# EAGLE design tm9 (EAGLE 9.6.2)
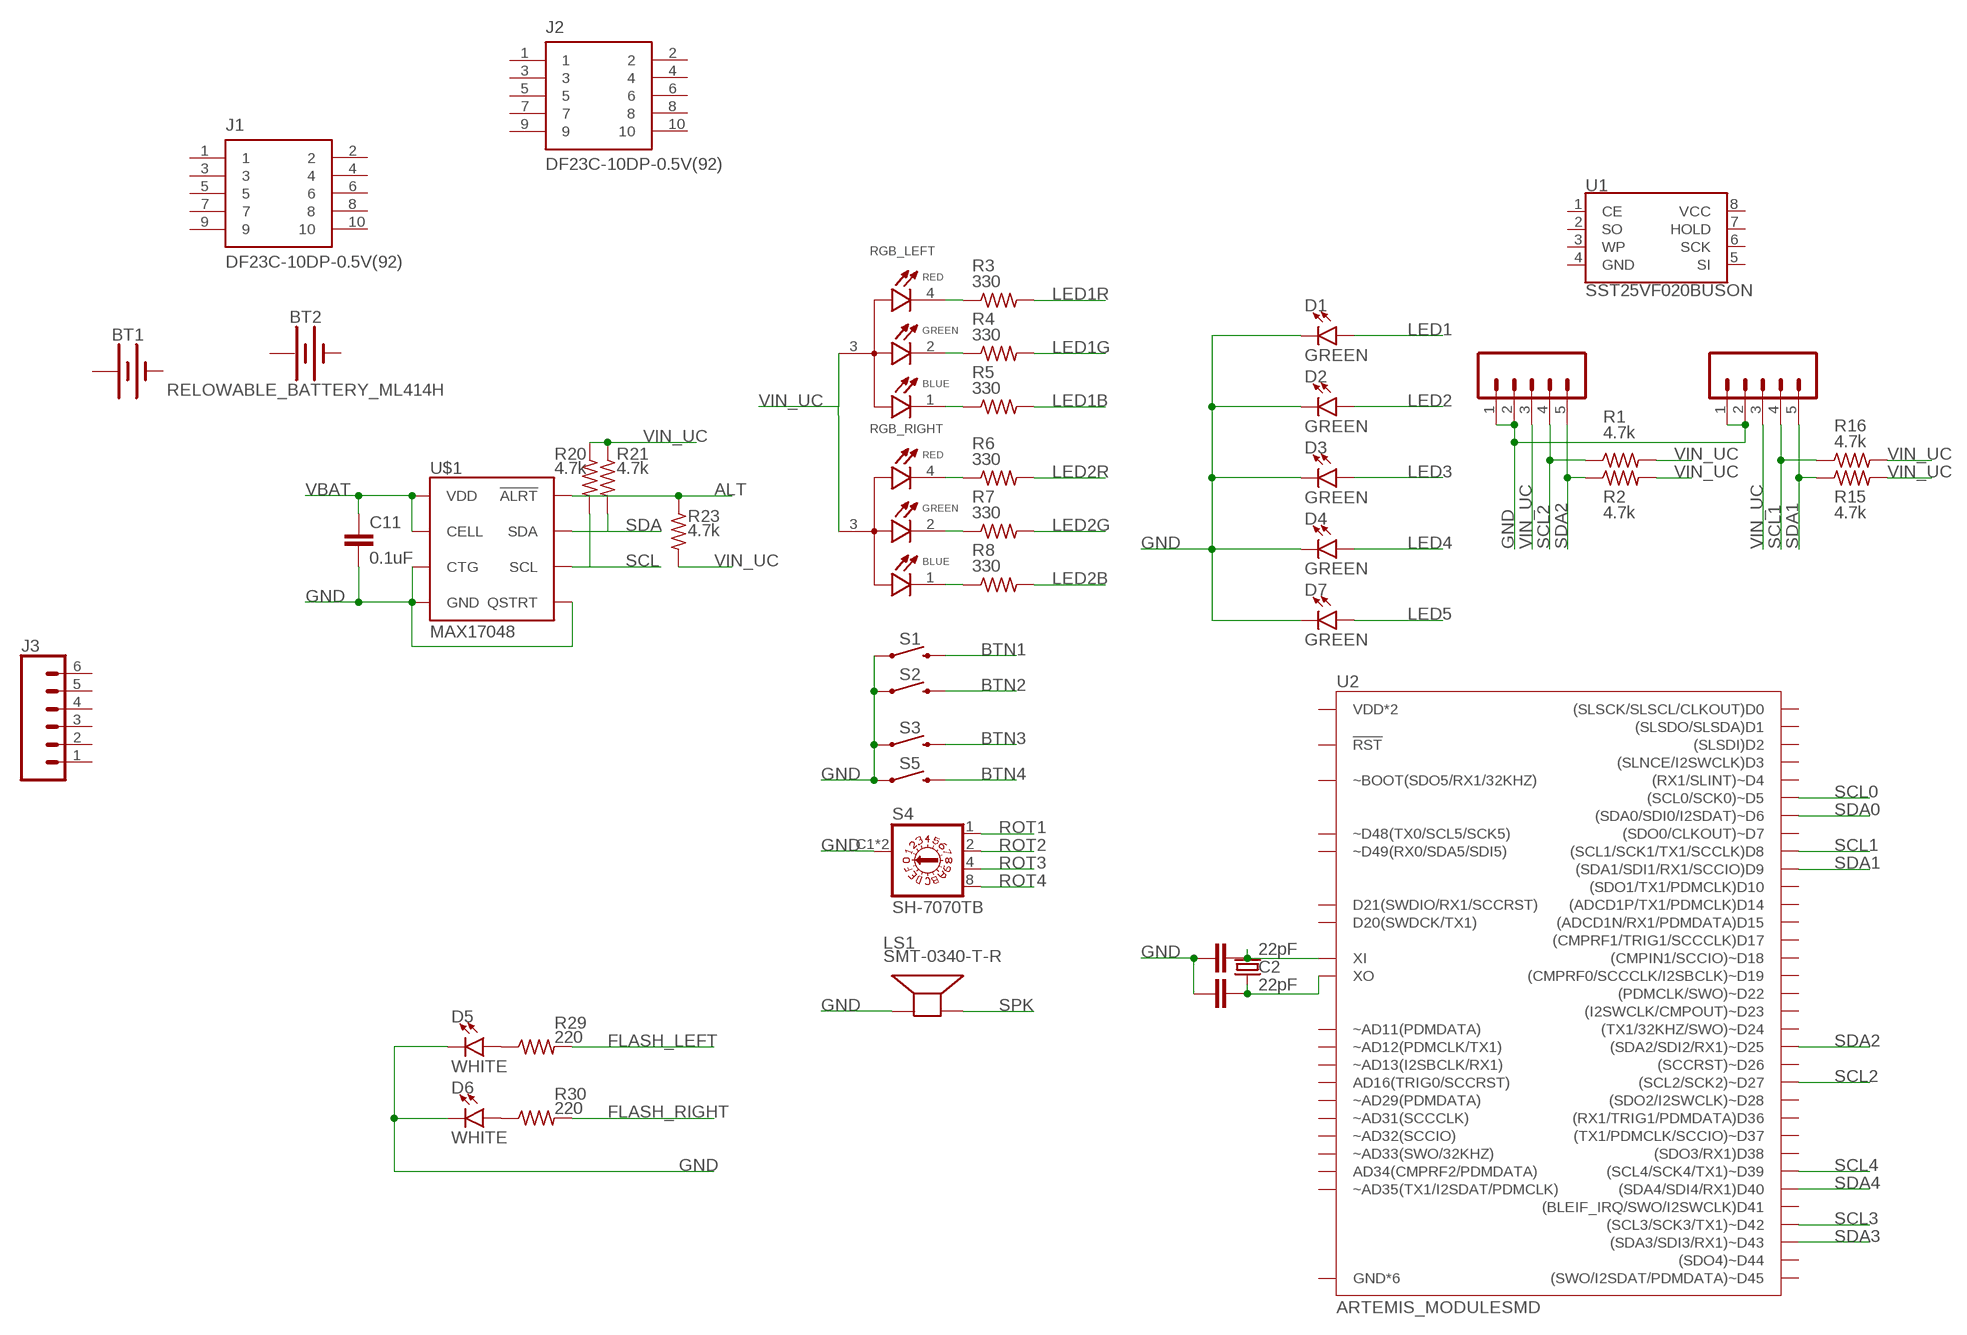
[diagram p0: schematic, sheet 1]

## Parts
BT1  BATTERY-20MM_SMD_4LEGS_OVERPASTE_INNER  [BATTCON_20MM_4LEGS_OVERPASTE_INNER]
BT2  RELOWABLE_BATTERY_ML414H  [ML414H_IV01E]
C1  22pF  C-EUC0402  [C0402]
C2  22pF  C-EUC0402  [C0402]
C11  0.1uF  C-EUC0402  [C0402]
D1  GREEN  LED-GREEN1206  [LED-1206]
D2  GREEN  LED-GREEN1206  [LED-1206]
D3  GREEN  LED-GREEN1206  [LED-1206]
D4  GREEN  LED-GREEN1206  [LED-1206]
D5  WHITE  LED-WHITE1206  [LED-1206]
D6  WHITE  LED-WHITE1206  [LED-1206]
D7  GREEN  LED-GREEN1206  [LED-1206]
J1  DF23C-10DP-0.5V(92)  [HIROSE_DF23C-10DP-0.5V(92)]
J2  DF23C-10DP-0.5V(92)  [HIROSE_DF23C-10DP-0.5V(92)]
J3  CONN_06JST-SMD-LOCKING  [JST-6-SMD-1.25MM-LOCKING]
LCD1  CONN_05VERT_FEMALE_HEADER  [1X05_SMD_VERTICAL_COMBO]
LCD2  CONN_05VERT_FEMALE_HEADER  [1X05_SMD_VERTICAL_COMBO]
LS1  SMT-0340-T-R  [XDCR_SMT-0340-T-R]
R1  4.7k  R-US_R0402  [R0402]
R2  4.7k  R-US_R0402  [R0402]
R3  330  R-US_R0402  [R0402]
R4  330  R-US_R0402  [R0402]
R5  330  R-US_R0402  [R0402]
R6  330  R-US_R0402  [R0402]
R7  330  R-US_R0402  [R0402]
R8  330  R-US_R0402  [R0402]
R15  4.7k  R-US_R0402  [R0402]
R16  4.7k  R-US_R0402  [R0402]
R20  4.7k  R-US_R0402  [R0402]
R21  4.7k  R-US_R0402  [R0402]
R23  4.7k  R-US_R0402  [R0402]
R29  220  R-US_R0402  [R0402]
R30  220  R-US_R0402  [R0402]
RGB_LEFT  EAST1616RGBA3  [LED_EAST1616RGBA3]
RGB_RIGHT  EAST1616RGBA3  [LED_EAST1616RGBA3]
S1  MOMENTARY-SWITCH-SPST-SMD-6.0X3.5MM  [TACTILE_SWITCH_SMD_6.0X3.5MM]
S2  MOMENTARY-SWITCH-SPST-SMD-6.0X3.5MM  [TACTILE_SWITCH_SMD_6.0X3.5MM]
S3  MOMENTARY-SWITCH-SPST-SMD-6.0X3.5MM  [TACTILE_SWITCH_SMD_6.0X3.5MM]
S4  SH-7070TB  [SH-7070B]
S5  MOMENTARY-SWITCH-SPST-SMD-6.0X3.5MM  [TACTILE_SWITCH_SMD_6.0X3.5MM]
U1  SST25VF020BUSON  [USON_3X2MM]
U2  ARTEMIS_MODULESMD  [ARTEMIS_FP]
U$1  MAX17048  MAX17048DFN8  [DFN-8]
Y1  32.768kHz  CRYSTAL-32.768KHZSMD-3.2X1.5  [CRYSTAL-SMD-3.2X1.5MM]

## Nets
ALT: R23.1 U$1.P$5(!ALRT)
BTN1: S1.2
BTN2: S2.2
BTN3: S3.2
BTN4: S5.2
FLASH_LEFT: R29.2
FLASH_RIGHT: R30.2
GND: C1.1 C2.1 C11.2 D1.C D2.C D3.C D4.C D5.C D6.C D7.C LCD1.1 LCD1.2 LCD2.1 LCD2.2 LS1.P S1.1 S2.1 S3.1 S4.C1(C) S4.C2(C) S5.1 U$1.P$1(CTG) U$1.P$4(GND) U$1.P$6(QSTRT) U$1.P$9(GND)
LED1: D1.A
LED1B: R5.2
LED1G: R4.2
LED1R: R3.2
LED2: D2.A
LED2B: R8.2
LED2G: R7.2
LED2R: R6.2
LED3: D3.A
LED4: D4.A
LED5: D7.A
N$5: R3.1 RGB_LEFT.4(R_C)
N$6: R4.1 RGB_LEFT.2(G_C)
N$7: R5.1 RGB_LEFT.1(B_C)
N$8: R6.1 RGB_RIGHT.4(R_C)
N$9: R7.1 RGB_RIGHT.2(G_C)
N$10: R8.1 RGB_RIGHT.1(B_C)
N$16: D5.A R29.1
N$18: D6.A R30.1
ROT1: S4.1
ROT2: S4.2
ROT3: S4.4
ROT4: S4.8
SCL: R20.2 U$1.P$7(SCL)
SCL0: U2.~D5((SCL0/SCK0)~D5)
SCL1: LCD2.4 R16.1 U2.D8((SCL1/SCK1/TX1/SCCLK)D8)
SCL2: LCD1.4 R1.1 U2.~D27((SCL2/SCK2)~D27)
SCL3: U2.~D42((SCL3/SCK3/TX1)~D42)
SCL4: U2.~D39((SCL4/SCK4/TX1)~D39)
SDA: R21.2 U$1.P$8(SDA)
SDA0: U2.~D6((SDA0/SDI0/I2SDAT)~D6)
SDA1: LCD2.5 R15.1 U2.D9((SDA1/SDI1/RX1/SCCIO)D9)
SDA2: LCD1.5 R2.1 U2.~D25((SDA2/SDI2/RX1)~D25)
SDA3: U2.~D43((SDA3/SDI3/RX1)~D43)
SDA4: U2.D40((SDA4/SDI4/RX1)D40)
SPK: LS1.N
VBAT: C11.1 U$1.P$2(CELL) U$1.P$3(VDD)
VIN_UC: LCD1.3 LCD2.3 R1.2 R2.2 R15.2 R16.2 R20.1 R21.1 R23.2 RGB_LEFT.3(A) RGB_RIGHT.3(A)
XIN32: C1.2 U2.XI Y1.P$2
XOUT32: C2.2 U2.XO Y1.P$1
Unconnected: J1.1 J1.2 J1.3 J1.4 J1.5 J1.6 J1.7 J1.8 J1.9 J1.10 J2.1 J2.2 J2.3 J2.4 J2.5 J2.6 J2.7 J2.8 J2.9 J2.10 J3.1 J3.2 J3.3 J3.4 J3.5 J3.6 U1.1(CE) U1.2(SO) U1.3(WP) U1.5(SI) U1.6(SCK) U1.7(HOLD) U2.AD16(AD16(TRIG0/SCCRST)) U2.AD34(AD34(CMPRF2/PDMDATA)) U2.BOOT(~BOOT(SDO5/RX1/32KHZ)) U2.D0((SLSCK/SLSCL/CLKOUT)D0) U2.D1((SLSDO/SLSDA)D1) U2.D2((SLSDI)D2) U2.D3((SLNCE/I2SWCLK)D3) U2.D7((SDO0/CLKOUT)~D7) U2.D10((SDO1/TX1/PDMCLK)D10) U2.D14((ADCD1P/TX1/PDMCLK)D14) U2.D15((ADCD1N/RX1/PDMDATA)D15) U2.D17((CMPRF1/TRIG1/SCCCLK)D17) U2.D36((RX1/TRIG1/PDMDATA)D36) U2.D38((SDO3/RX1)D38) U2.D41((BLEIF_IRQ/SWO/I2SWCLK)D41) U2.GND@1(GND*6) U2.GND@22(GND*6) U2.GND@38(GND*6) U2.GND@39(GND*6) U2.GND@47(GND*6) U2.GND@59(GND*6) U2.RXI-0(~D49(RX0/SDA5/SDI5)) U2.SWDCK(D20(SWDCK/TX1)) U2.SWDIO(D21(SWDIO/RX1/SCCRST)) U2.TXO-0(~D48(TX0/SCL5/SCK5)) U2.VDD@36(VDD*2) U2.VDD@37(VDD*2) U2.~AD11(~AD11(PDMDATA)) U2.~AD12(~AD12(PDMCLK/TX1)) U2.~AD13(~AD13(I2SBCLK/RX1)) U2.~AD29(~AD29(PDMDATA)) U2.~AD31(~AD31(SCCCLK)) U2.~AD32(~AD32(SCCIO)) U2.~AD33/SWO(~AD33(SWO/32KHZ)) U2.~AD35(~AD35(TX1/I2SDAT/PDMCLK)) U2.~D4((RX1/SLINT)~D4) U2.~D18((CMPIN1/SCCIO)~D18) U2.~D19((CMPRF0/SCCCLK/I2SBCLK)~D19) U2.~D22((PDMCLK/SWO)~D22) U2.~D23((I2SWCLK/CMPOUT)~D23) U2.~D24((TX1/32KHZ/SWO)~D24) U2.~D26((SCCRST)~D26) U2.~D28((SDO2/I2SWCLK)~D28) U2.~D37((TX1/PDMCLK/SCCIO)~D37) U2.~D44((SDO4)~D44) U2.~D45((SWO/I2SDAT/PDMDATA)~D45) U2.~RST(!RST)

## Notes on the sheet
- R20 | R21
- R23
- R29
- R30

## Power pins joined to a net without a drawn wire
+: BT1.1(+) BT2.+
-: BT1.2(-) BT2.-
GND: U1.4(GND)
VCC: U1.8(VCC)

## Library data of the parts
BT1 = SparkFun-Batteries:BATTERY: Battery - Single Cell A variety of battery chemistries, sizes, and footprints. Device List: 20MM_PTH - Coin Cell Battery Holder - 20mm (PTH) <https://www.sparkfun.com/products/783> 20MM_PTH_KIT- Coin Cell battery Holder - 20 mm (PTH) <http://www.sparkfun.com/products/783>kit version with special mask 6.8MM_PTH - Coin Cell Battery Holder - 6.8MM(SMD) <https://www.digikey.com/product-detail/en/seiko-instruments/MS621FE-FL11E/728-1057-ND/1889208?WT.srch=1&gclid=CNOQ5a6LzdQCFZS2wAodXCkE0g> 12MM_SMD - Coin Cell Battery Holder - 12mm (SMD) <https://www.sparkfun.com/products/10592> 12MM_PTH - Coin Cell Battery Holder - 12mm (PTH) <https://www.sparkfun.com/products/7948> 20MM_SMD - 20mm Coin Cell Battery Holder (SMD) (2 legs) Used on the Big Time Watch Kit <https://www.sparkfun.com/products/11734> 20MM_SMD_4LEGS - Coin Cell Battery Holder - 20mm (SMD) <https://www.sparkfun.com/products/11892> 20MM_SMD_4LEGS_OVERPASTE - Coin Cell Battery Holder - 20mm (SMD) <https://www.sparkfun.com/products/11892> (Over-paste on the legs) 24.5MM_PTH - Coin Cell Battery Holder - 24.5mm (PTH) <https://www.sparkfun.com/products/8863> 9V - 9V Battery Holder - PC Mount Used on the SparkFun SparkPunk Sound Kit <https://www.sparkfun.com/products/11177> and SparkFun SparkPunk Sequencer Kit <https://www.sparkfun.com/products/12707> 18650 - Battery Holder - 18650 (PTH) <https://www.sparkfun.com/products/13113> AA - Battery Holder - 1xAA (PTH) <https://www.sparkfun.com/products/7949> AAA - Battery Holder - 1xAAA (PTH) <https://www.sparkfun.com/products/12718> AA_KIT - Battery Holder - 1xAA (PTH) <https://www.sparkfun.com/products/7949> Special kit package - pads only have exposed copper on one side of the board. AAA_KIT - Battery Holder - 1xAAA (PTH) <https://www.sparkfun.com/products/12718> Special kit package - pads only have exposed copper on one side of the board.
BT2 = SparkFun-Batteries:RELOWABLE_BATTERY: SEIKO Reflowable Lithium Batteries; PROD_ID: BATT-14267
C1 C2 C11 = rcl:C-EU: CAPACITOR, European symbol; SPICEPREFIX: C
D1-D4 D7 = SparkFun-LED:LED-GREEN: Green SMD LED Used in manufacturing of various products at SparkFun Packages: 0603 - SMD 0603 package [Product Link] <http://www.futureelectronics.com/en/technologies/semiconductors/optoelectronics/leds/Pages/9894312-LTST-C190GKT.aspx?CrossPart=HSMG-C190&IM=0> LilyPad 1206 - SMD1206 LilyPad package [Product Link] <http://www.futureelectronics.com/en/Technologies/Product.aspx?ProductID=IN150NGHARVATEKCORPORATION2049943&IM=0> 1206 - SMD1206 package [Product Link] <http://www.futureelectronics.com/en/technologies/semiconductors/optoelectronics/leds/Pages/8315665-LTST-C150KGKT.aspx?IM=0> 1206 Bottom Mount -SMD 1206 Bottom Mount [Product Link] <http://www.digikey.com/product-detail/en/lite-on-inc/LTST-C230KGKT/160-1456-1-ND/386854> SparkFun Products: Pro Mini 328 -5V <https://www.sparkfun.com/products/821> RedBoard <https://www.sparkfun.com/products/12757> MP3 Trigger <https://www.sparkfun.com/products/13720> Makey Makey <https://www.sparkfun.com/products/11076>; PROD_ID: DIO-00862
D5 D6 = SparkFun-LED:LED-WHITE: White SMD LED Used in manufacturing several products at SparkFun. Packages: 0603 - Bright White SMD 0603 package[Product Link] <http://www.kingbrightusa.com/product.asp?catalog_name=LED&product_id=APT1608QWF/D> 1206 - Bright White SMD1206 package [Product Link] <http://www.kingbrightusa.com/product.asp?catalog_name=LED&product_id=APT3216QWF/D> 3014 - Super Bright SMD 3014 package [Datasheet] <http://www.lumileds.com/uploads/459/DS208-pdf> SparkFun Products: Blackberry Trackballer Breakout <https://www.sparkfun.com/products/13169> Digital SandBox <https://www.sparkfun.com/products/12651>; PROD_ID: DIO-09955
J1 J2 = DF23C-10DP-0.5V_92_:DF23C-10DP-0.5V(92): 10 Position Connector Plug, Outer Shroud Contacts Surface Mount Gold; MANUFACTURER: Hirose; MAXIMUM_PACKAGE_HEIGHT: 1.3 mm; PARTREV: N/A; STANDARD: Manufacturer Recommendations
J3 = SparkFun-Connectors:CONN_06: Multi connection point. Often used as Generic Header-pin footprint for 0.1 inch spaced/style header connections On any of the 0.1 inch spaced packages, you can populate with these: Break Away Headers - Straight <https://www.sparkfun.com/products/116> (PRT-00116) Break Away Male Headers - Right Angle <https://www.sparkfun.com/products/553> (PRT-00553) Female Headers <https://www.sparkfun.com/products/115> (PRT-00115) Break Away Headers - Machine Pin <https://www.sparkfun.com/products/117> (PRT-00117) Break Away Female Headers - Swiss Machine Pin <https://www.sparkfun.com/products/743> (PRT-00743) Arduino Stackable Header - 6 Pin <https://www.sparkfun.com/products/9280> (PRT-09280) Screw Terminals 2.54mm Pitch (6-Pin) <https://www.sparkfun.com/products/16499> (PRT-16499) For SCREWTERMINALS and SPRING TERMINALS visit here: Screw Terimnals on SparkFun.com <https://www.sparkfun.com/search/results?term=Screw+Terminals> (5mm/3.5mm/2.54mm spacing) This device is also useful as a general connection point to wire up your design to another part of your project. Our various solder wires solder well into these plated through hole pads. Hook-Up Wire - Assortment (Stranded, 22 AWG) <https://www.sparkfun.com/products/11375> (PRT-11375) Hook-Up Wire - Assortment (Solid Core, 22 AWG) <https://www.sparkfun.com/products/11367> (PRT-11367) View the entire wire category on our website here <https://www.sparkfun.com/categories/141>; PROD_ID: CONN-16497
LCD1 LCD2 = SparkFun-Connectors:CONN_05: Multi connection point. Often used as Generic Header-pin footprint for 0.1 inch spaced/style header connections On any of the 0.1 inch spaced packages, you can populate with these: Break Away Headers - Straight <https://www.sparkfun.com/products/116> (PRT-00116) Break Away Male Headers - Right Angle <https://www.sparkfun.com/products/553> (PRT-00553) Female Headers <https://www.sparkfun.com/products/115> (PRT-00115) Break Away Headers - Machine Pin <https://www.sparkfun.com/products/117> (PRT-00117) Break Away Female Headers - Swiss Machine Pin <https://www.sparkfun.com/products/743> (PRT-00743) For SCREWTERMINALS and SPRING TERMINALS visit here: Screw Terimnals on SparkFun.com <https://www.sparkfun.com/search/results?term=Screw+Terminals> (5mm/3.5mm/2.54mm spacing) This device is also useful as a general connection point to wire up your design to another part of your project. Our various solder wires solder well into these plated through hole pads. Hook-Up Wire - Assortment (Stranded, 22 AWG) <https://www.sparkfun.com/products/11375> (PRT-11375) Hook-Up Wire - Assortment (Solid Core, 22 AWG) <https://www.sparkfun.com/products/11367> (PRT-11367) View the entire wire category on our website here <https://www.sparkfun.com/categories/141> Special notes: Molex polarized connector foot print use with SKU : PRT-08231 with associated crimp pins and housings. 1MM SMD Version SKU: PRT-10208; PROD_ID: CONN-15262
LS1 = SMT-0340-T-R:SMT-0340-T-R; MANUFACTURER: Pui Audio; MAXIMUM_PACKAGE_HEIGHT: 2.00 mm; PARTREV: 3/10/2020; STANDARD: Manufacturer Recomemndations
R1-R8 R15 R16 R20 R21 R23 R29 R30 = rcl:R-US_: RESISTOR, American symbol; SPICEPREFIX: R
RGB_LEFT RGB_RIGHT = EAST1616RGBA3:EAST1616RGBA3: Red, Green, Blue (RGB) LED Indication - Discrete 1.95V Red, 2.8V Green, 2.8V Blue 0606 (1616 Metric) Check availability <https://pricing.snapeda.com/parts/EAST1616RGBA3/Everlight%20Electronics/view-part?ref=eda>; AVAILABILITY: In Stock; DESCRIPTION: Red, Green, Blue (RGB) - LED Indication - Discrete 1.95V Red, 2.8V Green, 2.8V Blue 0606 (1616 Metric); MF: Everlight Electronics; MP: EAST1616RGBA3; PACKAGE: 0606 Everlight; PRICE: None; PURCHASE-URL: https://pricing.snapeda.com/search/part/EAST1616RGBA3/?ref=eda
S1-S3 S5 = SparkFun-Switches:MOMENTARY-SWITCH-SPST: Momentary Switch (Pushbutton) - SPST Normally-open (NO) SPST momentary switches (buttons, pushbuttons). Variants PTH-12MM - 12mm square, through-hole Momentary Pushbutton Switch - 12mm Square <https://www.sparkfun.com/products/9190> (COM-09190) PTH-6.0MM, PTH-6.0MM-KIT - 6.0mm square, through-hole Mini Pushbutton Switch <https://www.sparkfun.com/products/97> (COM-00097) KIT package intended for soldering kit's - only one side of pads' copper is exposed. PTH-RIGHT-ANGLE-KIT - Right-angle, through-hole Right Angle Tactile Button <https://www.sparkfun.com/products/10791> - Used on SparkFun BigTime Watch Kit <https://www.sparkfun.com/products/11734> SMD-12MM - 12mm square, surface-mount Tactile Button - SMD (12mm) <https://www.sparkfun.com/products/12993> (COM-12993) Used on SparkFun PicoBoard <https://www.sparkfun.com/products/11888> SMD-4.5MM - 4.5mm Square Trackball Switch Used on SparkFun Blackberry Trackballer Breakout <https://www.sparkfun.com/products/13169> SMD-4.6MMX2.8MM - 4.60mm x 2.80mm, surface mount Used on SparkFun Pro Micro - RP2040 <https://www.sparkfun.com/products/17717> SMD-5.2MM, SMD-5.2-REDUNDANT - 5.2mm square, surface-mount Mini Pushbutton Switch - SMD <https://www.sparkfun.com/products/8720> (COM-08720) Used on Arduino Pro Mini <https://www.sparkfun.com/products/11114> REDUNDANT package connects both switch circuits together SMD-6.0X3.5MM - 6.0 x 3.5mm, surface mount Momentary Reset Switch SMD <https://www.sparkfun.com/products/8229> (COM-08229) SMD-6.2MM-TALL - 6.2mm square, surface mount Tactile Button - SMD (6mm) <https://www.sparkfun.com/products/12992> Used on SparkFun Digital Sandbox <https://www.sparkfun.com/products/12651> SMD-RIGHT-ANGLE - Right-angle, surface mount Used on SparkFun Block for Intel® Edison - Arduino <https://www.sparkfun.com/products/13036>; PROD_ID: SWCH-14278; SF_SKU: COM-08229
S4 = SH-7070TB:SH-7070TB: ROTARY CODED HEX SWITCH Check availability <https://pricing.snapeda.com/parts/SH-7070TB/Nidec%20Copal/view-part?ref=eda>; AVAILABILITY: In Stock; DESCRIPTION: Dip Switch Hexadecimal Complement 16 Position Surface Mount Rotary for Tool Actuator 100mA 5VDC; MF: Nidec Copal; MP: SH-7070TB; PACKAGE: None; PRICE: None; PURCHASE-URL: https://pricing.snapeda.com/search/part/SH-7070TB/?ref=eda
U1 = SparkFun-IC-Memory:SST25VF020B: 2Mbit Serial Flash Memory 8pin SPI Flash Datasheet <http://ww1.microchip.com/downloads/en/DeviceDoc/20005054D.pdf>; DIGIKEY_PART: SST25VF020B-80-4I-Q3AE-TCT-ND; MANU_PART: SST25VF020B-80-4I-Q3AE-T; PROD_ID: IC-15716
U2 = SparkFun-IC-Microcontroller:ARTEMIS_MODULE: Description: The Artemis Module from SparkFun is a Cortex-M4F with BLE 5.0 running up to 96MHz and with as low power as 6uA per MHz (less than 5mW). This is the world's first module to bridge the market between hobbyists and consumer products. We've packaged all the power of a modern microcontroller into a module that is both extremely easy to use but is mass-market ready. The flexibility of the Artemis module starts with our [Arduino core](https://github.com/sparkfun/Arduino_Apollo3). You can program and use the Artemis module just like you would an Uno or any other Arduino. Time to first blink is just 5 minutes away! We built the core from the ground up, making it fast and as light weight as possible.; PROD_ID: SUB-14402
U$1 = SparkFun-IC-Power:MAX17048: Micropower 1-Cell Li+ ModelGauge SparkFun Products Qduino Mini <https://www.sparkfun.com/products/13614> (DEV-13614); PROD_ID: IC-12551
Y1 = SparkFun-Clocks:CRYSTAL-32.768KHZ: 32.768kHz Crystal Frequency: 32.768kHz Frequency Stability: ±20ppm Load Capacitance: 12.5pF (PTH-2X6 & SMD-3.2X1.5), 6pF (SMD-2X6) SparkFun Products: SparkFun BigTime Watch Kit <https://www.sparkfun.com/products/11734> SparkFun nRF52832 Breakout <https://www.sparkfun.com/products/13990> SparkFun Real Time Clock Module <https://www.sparkfun.com/products/12708>; PROD_ID: XTAL-13062

## Board
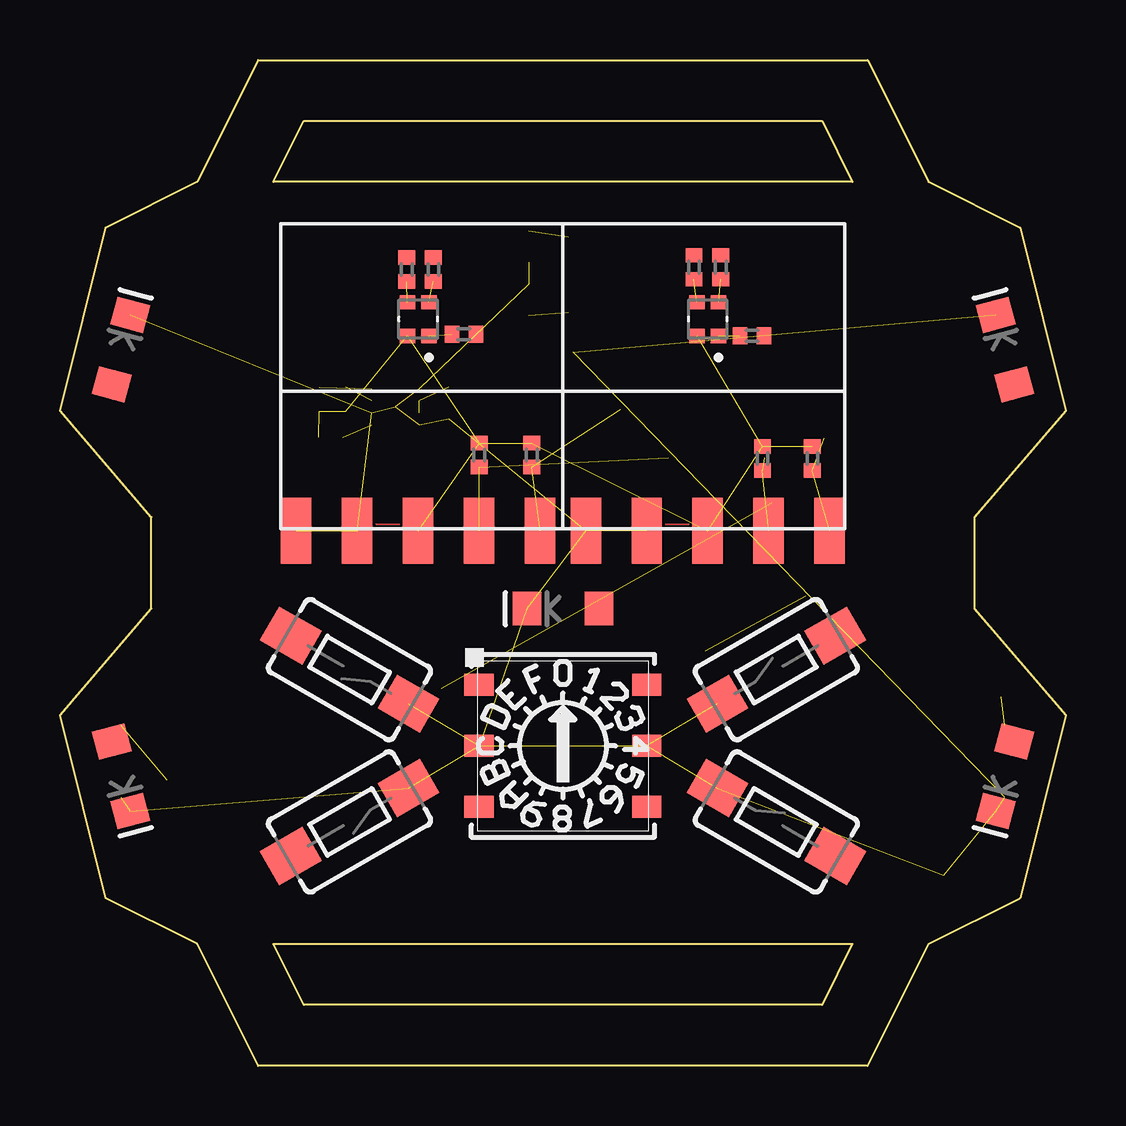
[diagram p1: board, top side]
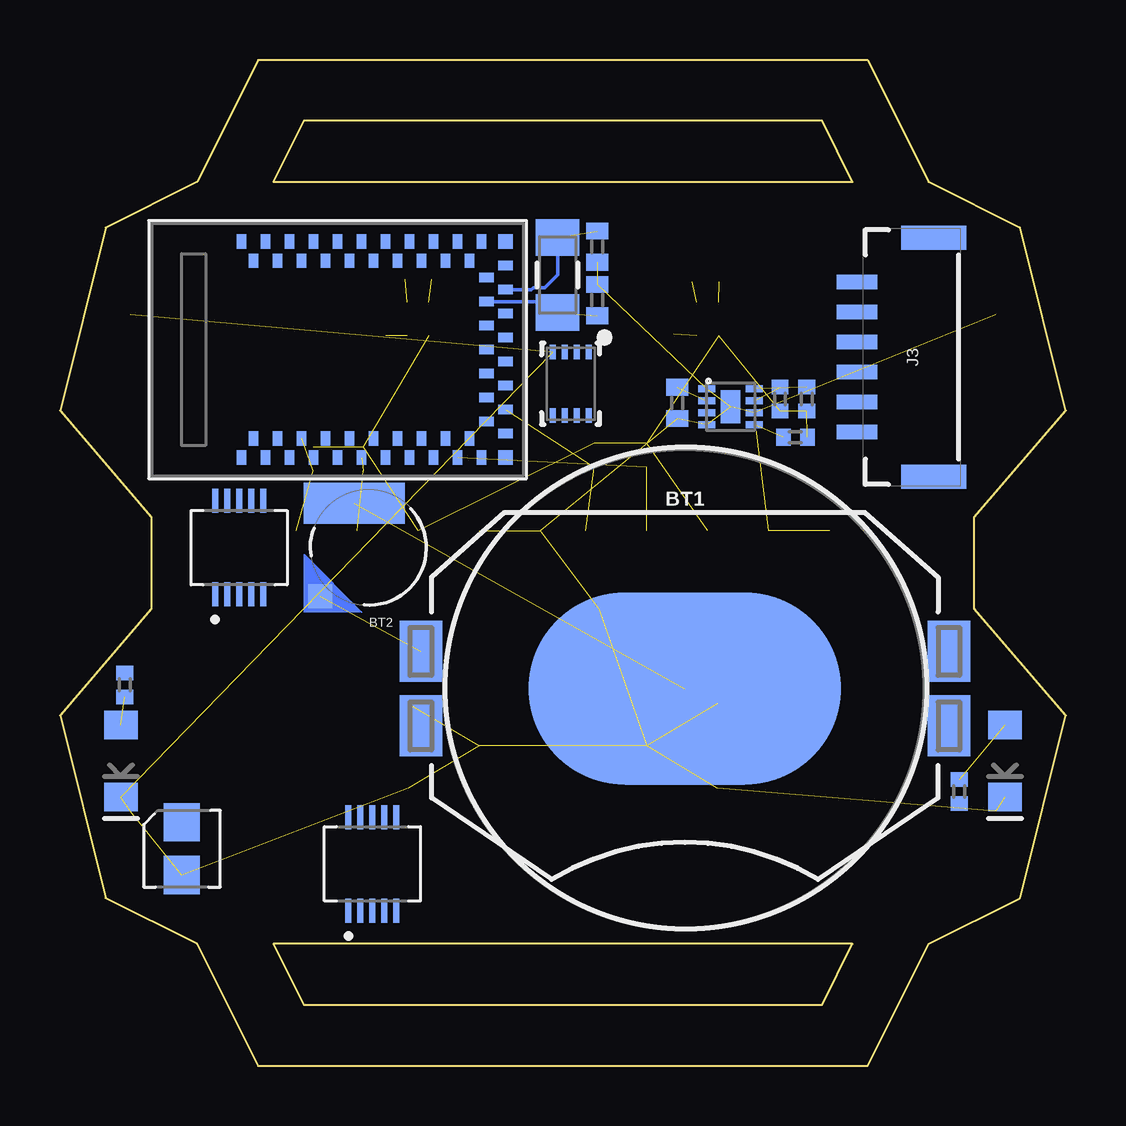
[diagram p2: board, bottom side, seen from below]

Size 41.91 x 41.91 mm. Coordinates in mm from the lower left corner, seen from the top.
Outline: 33.66,0 8.25,0 5.71,5.08 1.9,6.99 0,14.6 3.81,19.05 3.81,22.86 0,27.3 1.9,34.92 5.71,36.83 8.25,41.91 33.66,41.91 36.2,36.83 40,34.92 41.91,27.3 38.1,22.86 38.1,19.05 41.91,14.6 40,6.99 36.2,5.08 33.66,0
Outline: 8.89,36.83 10.16,39.37 31.75,39.37 33.02,36.83 8.89,36.83
Outline: 33.02,5.08 31.75,2.54 10.16,2.54 8.89,5.08 33.02,5.08
Copper layers (1*16): Top 0.035mm / dielectric 1.5mm / Bottom 0.035mm
Design rules "SparkFun *": minimum track width 6mil, minimum drill 0.29971875mm, track to track 8mil, track to pad 8mil, pad to pad 8mil, via to via 8mil, smd to smd 8mil, copper to edge 10mil, drill to drill 8mil, minimum pad ring 12mil, minimum via ring 10mil, stop-mask expansion 4mil, vias tented up to drill 25mil, thermal gap 10mil

### Footprints (pad centres in the part's own frame; a part is rotated, then mirrored left to right if it is on the bottom)
BATTCON_20MM_4LEGS_OVERPASTE_INNER = smd 1.778 x 2.54: 1 -11,1.55; 3 11,1.55; P$1 -11,-1.55; P$2 11,-1.55 | smd 13 x 8: 2 0,0
ML414H_IV01E = smd 1 x 1: + 2.022,2.032 | smd 4.2 x 1.7: - 0.6,-1.85
C0402 = smd 0.7 x 0.9: 1 -0.65,0; 2 0.65,0
LED-1206 = smd 1.2 x 1.4: A -1.5,0; C 1.5,0
HIROSE_DF23C-10DP-0.5V(92) = smd 0.25 x 1: 1 -1,-1.95; 2 -1,1.95; 3 -0.5,-1.95; 4 -0.5,1.95; 5 0,-1.95; 6 0,1.95; 7 0.5,-1.95; 8 0.5,1.95; 9 1,-1.95; 10 1,1.95
JST-6-SMD-1.25MM-LOCKING = smd 0.6 x 1.7: 1 -3.125,3.3; 2 -1.875,3.3; 3 -0.625,3.3; 4 0.625,3.3; 5 1.875,3.3; 6 3.125,3.3 | smd 1 x 2.7: NC1 4.975,0.1; NC2 -4.975,0.1
1X05_SMD_VERTICAL_COMBO = smd 1.27 x 2.75: 1 0,1.65; 2 2.54,1.65; 3 5.08,1.65; 4 7.62,1.652; 5 10.16,1.65
XDCR_SMT-0340-T-R = smd 1.5 x 1.6: N 0,1.1; P 0,-1.1
R0402 = smd 0.6 x 0.7: 1 -0.5,0; 2 0.5,0
LED_EAST1616RGBA3 = smd 0.6 x 0.65: 1 0.7,0.45; 2 -0.7,0.45; 3 0.7,-0.45; 4 -0.7,-0.45
TACTILE_SWITCH_SMD_6.0X3.5MM = smd 2.032 x 1.626: 1 -2.833,0; 2 2.833,0
SH-7070B = smd 1.219 x 0.914: 1 -2.223,3.81; 2 4.763,-1.27; 4 -2.223,-1.27; 8 4.763,3.81; C1 -2.223,1.27; C2 4.763,1.27
USON_3X2MM = smd 0.6 x 0.25: 1 -1.325,0.75; 2 -1.325,0.25; 3 -1.325,-0.25; 4 -1.325,-0.75; 5 1.325,-0.75; 6 1.325,-0.25; 7 1.325,0.25; 8 1.325,0.75
ARTEMIS_FP = smd 0.4 x 0.6: AD16 -4,-3.7; BOOT 1.5,4.5; D0 0.5,-4.5; D1 -0.5,-4.5; D2 -1,-3.7; D3 2,-3.7; D7 -1.5,4.5; D8 -0.5,4.5; D9 2,3.7; D10 1,3.7; D14 -5,3.7; D17 -3.5,-4.5; D36 2.5,-4.5; D38 3,-3.7; D40 2.5,4.5; D41 -2.5,-4.5; GND@1 4.5,4.5; GND@39 -5.5,-4.5; GND@47 -1.5,-4.5; GND@59 4.5,-4.5; RXI-0 3.5,4.5; SWDCK 4,3.7; SWDIO 0,3.7; TXO-0 0.5,4.5; ~AD31 -3,-3.7; ~AD35 -2,3.7; ~D4 -2.5,4.5; ~D5 -1,3.7; ~D18 -4.5,-4.5; ~D19 -5,-3.7; ~D22 -3.5,4.5; ~D23 -4,3.7; ~D24 -3,3.7; ~D27 -4.5,4.5; ~D28 -5.5,4.5; ~D37 3.5,-4.5; ~D39 3,3.7; ~D42 1.5,-4.5; ~D43 1,-3.7; ~D44 4,-3.7; ~D45 -2,-3.7; ~RST 0,-3.7 | smd 0.6 x 0.4: AD34 -6.5,-0.5; D15 -6.5,0.5; VDD@36 -5.7,-3; VDD@37 -6.5,-3.5; XI -6.5,-2.5; XO -5.7,-2; ~AD11 -5.7,-1; ~AD12 -5.7,2; ~AD13 -5.7,1; ~AD29 -6.5,-1.5; ~AD32 -5.7,3; ~AD33/SWO -5.7,0; ~D6 -6.5,3.5; ~D25 -6.5,2.5; ~D26 -6.5,1.5 | smd 0.6 x 0.6: GND@22 -6.5,4.5; GND@38 -6.5,-4.5
DFN-8 = smd 0.3 x 0.7: P$1 -0.75,-0.99; P$2 -0.25,-0.99; P$3 0.25,-0.99; P$4 0.75,-0.99; P$5 0.75,0.99; P$6 0.25,0.99; P$7 -0.25,0.99; P$8 -0.75,0.99 | smd 1.38 x 0.8: P$9 0,0
CRYSTAL-SMD-3.2X1.5MM = smd 1.524 x 1.8: P$1 -1.567,0; P$2 1.567,0

### Placement (x,y rotation side)
BT1  15.88,15.72 0 bottom
BT2  29.05,21.59 180 bottom
C1  19.53,34.13 90 bottom
C2  19.53,31.91 270 bottom
C11  16.19,27.62 270 bottom
D1  2.54,29.84 75 top
D2  2.54,12.06 285 top
D3  39.37,12.06 255 top
D4  39.37,29.84 105 top
D5  2.54,12.7 270 bottom
D6  39.37,12.7 270 bottom
D7  20.95,19.05 180 top
J1  34.45,21.59 0 bottom
J2  28.89,8.41 0 bottom
J3  5.4,29.53 90 bottom
LCD1  9.84,20.64 0 top
LCD2  21.91,20.64 0 top
LS1  36.83,9.05 0 bottom
R1  17.47,25.45 90 top
R2  19.66,25.45 90 top
R3  14.45,33.18 90 top
R4  15.56,33.18 90 top
R5  16.83,30.48 0 top
R6  26.42,33.27 90 top
R7  27.53,33.27 90 top
R8  28.83,30.42 0 top
R15  31.35,25.3 90 top
R16  29.27,25.3 90 top
R20  11.91,27.78 90 bottom
R21  10.8,27.78 90 bottom
R23  11.27,26.19 0 bottom
R29  4.44,11.43 270 bottom
R30  39.21,15.87 90 bottom
RGB_LEFT  14.92,31.11 270 top
RGB_RIGHT  26.99,31.11 270 top
S1  12.06,16.51 150 top
S2  29.84,16.51 30 top
S3  12.06,10.16 210 top
S4  19.68,12.06 0 top
S5  29.84,10.16 330 top
U1  20.64,28.42 270 bottom
U2  29.84,29.84 180 bottom
U$1  13.97,27.46 270 bottom
Y1  21.18,32.95 90 bottom

### Tracks (layer width: path | path; a pad name or v marks a point on that pad's centre or on a via)
+  (1 unrouted)
-  (1 unrouted)
ALT  (1 unrouted)
GND  (25 unrouted)
N$5  (1 unrouted)
N$6  (1 unrouted)
N$7  (1 unrouted)
N$8  (1 unrouted)
N$9  (1 unrouted)
N$10  (1 unrouted)
N$16  (1 unrouted)
N$18  (1 unrouted)
SCL  (1 unrouted)
SCL1  (2 unrouted)
SCL2  (2 unrouted)
SDA  (1 unrouted)
SDA1  (2 unrouted)
SDA2  (2 unrouted)
VBAT  (2 unrouted)
VIN_UC  (10 unrouted)
XIN32  (1 unrouted)
  Bottom 0.152: U2.XI 22.27,32.34 22.19,32.43 21.71,32.43 21.18,32.96 Y1.P$2
XOUT32  (1 unrouted)
  Bottom 0.152: U2.XO 21.64,31.84 Y1.P$1